# EAGLE board c65Keyb (EAGLE 7.1.0), part 1 of 2
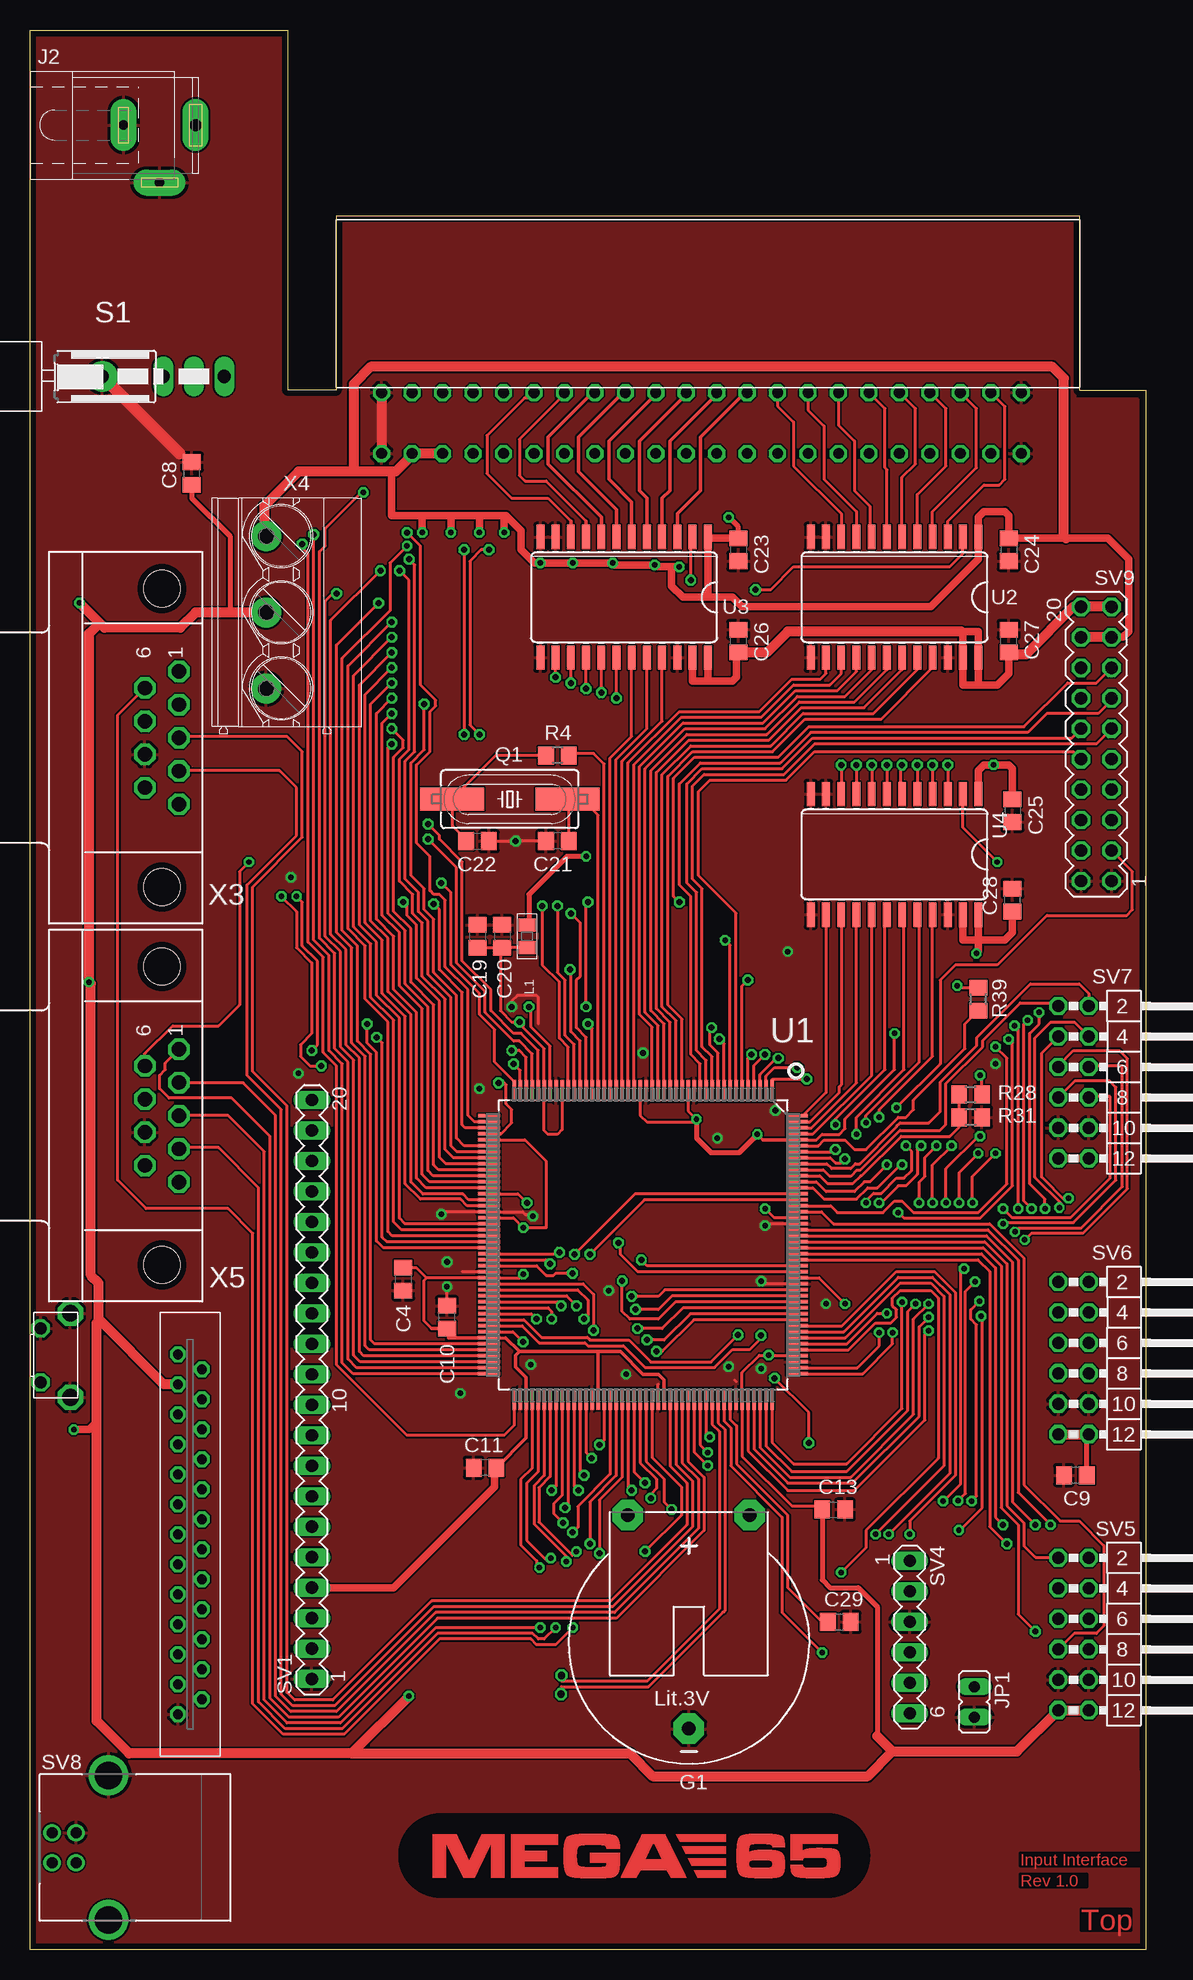
[diagram p2: board, top side]
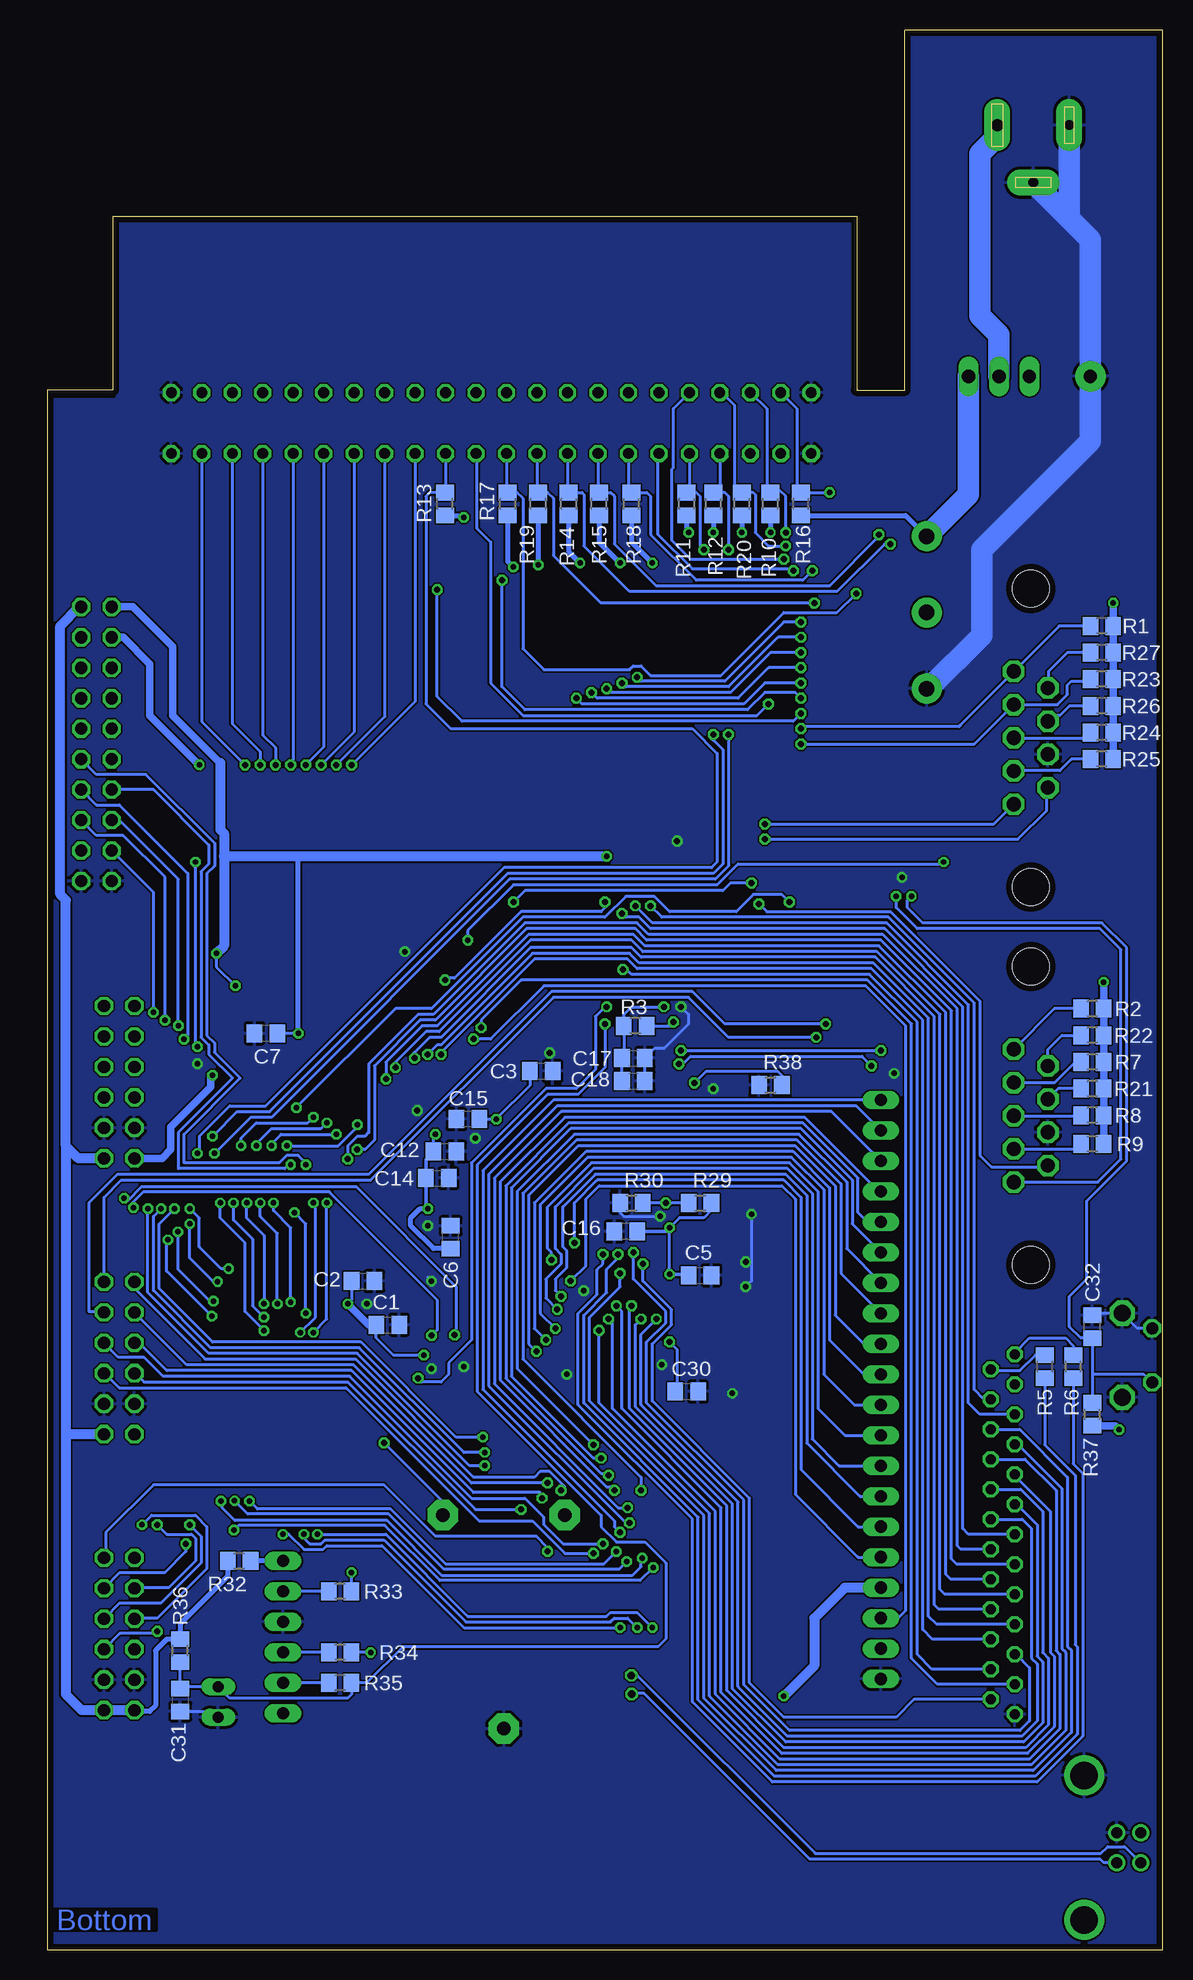
[diagram p3: board, bottom side, seen from below]

Size 93 x 160 mm. Coordinates in mm from the lower left corner, seen from the top.
Outline: 0,0 0,160 21.5,160 21.5,130 25.5,130 25.5,144.5 87.5,144.5 87.5,130 93,130 93,0 0,0
Copper layers (1*16): Top 0.035mm / dielectric 1.5mm / Bottom 0.035mm
Design rules "default *": minimum track width 0mil, minimum drill 18mil, track to track 6mil, track to pad 6mil, pad to pad 6mil, via to via 6mil, smd to smd 6mil, copper to edge 20mil, drill to drill 8mil, minimum pad ring 10mil, minimum via ring 8mil, stop-mask expansion 4mil, vias tented up to drill 0mil, thermal gap 10mil
tRestrict: area 34.1,4.3 to 66.6,4.3; area 34,4.3 to 66.8,4.3; area 33.9,4.3 to 66.9,4.3; area 33.8,4.3 to 66.9,4.4; area 33.7,4.4 to 67,4.4; area 33.7,4.4 to 67.1,4.4; area 33.6,4.4 to 67.1,4.4; area 33.6,4.4 to 67.2,4.4; area 33.5,4.4 to 67.2,4.4; area 33.5,4.4 to 67.3,4.4; area 33.4,4.4 to 67.3,4.4; area 33.4,4.4 to 67.4,4.4; 4388 more areas

## Footprints (pad centres in the part's own frame; a part is rotated, then mirrored left to right if it is on the bottom)
C0805 = smd 1.3 x 1.5: 1 -0.95,0; 2 0.95,0
CR2032H = drill 1.118 pad 2.54 octagon: + 5.08,10.795; +@1 -5.08,10.795; - 0,-6.985
SPC4078 = drill 0.8 pad 2.184 long: 1 -3,0; 2 0,-4.8 | drill 1 pad 2.184 long: 3 3,0
JP1 = drill 0.914 long: 1 0,-1.27; 2 0,1.27
SMD0805-ALT = smd 1.092 x 1.397: 1 -0.94,0; 2 0.94,0
HC49UP = smd 5.334 x 1.93: 1 -4.826,0; 2 4.826,0
R0805 = smd 1.3 x 1.5: 1 -0.95,0; 2 0.95,0
LPV-1 = drill 1.1 long: 1 0,20.32; 2 0,22.86; 3 0,25.4 | drill 1.1 pad 2.54: B1 0,15.24
MA20-1 = drill 1.016 long: 1 -24.13,0; 2 -21.59,0; 3 -19.05,0; 4 -16.51,0; 5 -13.97,0; 6 -11.43,0; 7 -8.89,0; 8 -6.35,0; 9 -3.81,0; 10 -1.27,0; 11 1.27,0; 12 3.81,0; 13 6.35,0; 14 8.89,0; 15 11.43,0; 16 13.97,0; 17 16.51,0; 18 19.05,0; 19 21.59,0; 20 24.13,0
C65_MOLEX_KEYB = drill 0.8 octagon: 1 -15,1; 2 -13.75,-1; 3 -12.5,1; 4 -11.25,-1; 5 -10,1; 6 -8.75,-1; 7 -7.5,1; 8 -6.25,-1; 9 -5,1; 10 -3.75,-1; 11 -2.5,1; 12 -1.25,-1; 13 0,1; 14 1.25,-1; 15 2.5,1; 16 3.75,-1; 17 5,1; 18 6.25,-1; 19 7.5,1; 20 8.75,-1; 21 10,1; 22 11.25,-1; 23 12.5,1; 24 13.75,-1; 25 15,1
EDGE-CON-44 = drill 0.9 pad 1.422 octagon: 1 3.81,0; 2 6.35,0; 3 8.89,0; 4 11.43,0; 5 13.97,0; 6 16.51,0; 7 19.05,0; 8 21.59,0; 9 24.13,0; 10 26.67,0; 11 29.21,0; 12 31.75,0; 13 34.29,0; 14 36.83,0; 15 39.37,0; 16 41.91,0; 17 44.45,0; 18 46.99,0; 19 49.53,0; 20 52.07,0; 21 54.61,0; 22 57.15,0; A 3.81,5.08; B 6.35,5.08; C 8.89,5.08; D 11.43,5.08; E 13.97,5.08; F 16.51,5.08; H 19.05,5.08; J 21.59,5.08; K 24.13,5.08; L 26.67,5.08; M 29.21,5.08; N 31.75,5.08; P 34.29,5.08; R 36.83,5.08; S 39.37,5.08; T 41.91,5.08; U 44.45,5.08; V 46.99,5.08; W 49.53,5.08; X 52.07,5.08; Y 54.61,5.08; Z 57.15,5.08
MA06-1 = drill 1.016 long: 1 -6.35,0; 2 -3.81,0; 3 -1.27,0; 4 1.27,0; 5 3.81,0; 6 6.35,0
MA06-2W = drill 1.016 octagon: 1 -6.35,-1.27; 2 -6.35,1.27; 3 -3.81,-1.27; 4 -3.81,1.27; 5 -1.27,-1.27; 6 -1.27,1.27; 7 1.27,-1.27; 8 1.27,1.27; 9 3.81,-1.27; 10 3.81,1.27; 11 6.35,-1.27; 12 6.35,1.27
USB-B-THG-01 = drill 0.92: 1 1.25,14.99; 2 -1.25,14.99; 3 -1.25,12.99; 4 1.25,12.99 | drill 2.3: G1 6.02,10.28; G2 -6.02,10.28
MA10-2 = drill 1.016 octagon: 1 -11.43,-1.27; 2 -11.43,1.27; 3 -8.89,-1.27; 4 -8.89,1.27; 5 -6.35,-1.27; 6 -6.35,1.27; 7 -3.81,-1.27; 8 -3.81,1.27; 9 -1.27,-1.27; 10 -1.27,1.27; 11 1.27,-1.27; 12 1.27,1.27; 13 3.81,-1.27; 14 3.81,1.27; 15 6.35,-1.27; 16 6.35,1.27; 17 8.89,-1.27; 18 8.89,1.27; 19 11.43,-1.27; 20 11.43,1.27
MICRO_SWITCH = drill 1 octagon: 1 -2.25,0.56; 2 2.25,0.56 | drill 1.4 octagon: 3 -3.505,3.05; 4 3.505,3.05
QFP176 = smd 1.8 x 0.3: 1 -12.85,10.75; 2 -12.85,10.25; 3 -12.85,9.75; 4 -12.85,9.25; 5 -12.85,8.75; 6 -12.85,8.25; 7 -12.85,7.75; 8 -12.85,7.25; 9 -12.85,6.75; 10 -12.85,6.25; 11 -12.85,5.75; 12 -12.85,5.25; 13 -12.85,4.75; 14 -12.85,4.25; 15 -12.85,3.75; 16 -12.85,3.25; 17 -12.85,2.75; 18 -12.85,2.25; 19 -12.85,1.75; 20 -12.85,1.25; 21 -12.85,0.75; 22 -12.85,0.25; 23 -12.85,-0.25; 24 -12.85,-0.75; 25 -12.85,-1.25; 26 -12.85,-1.75; 27 -12.85,-2.25; 28 -12.85,-2.75; 29 -12.85,-3.25; 30 -12.85,-3.75; 31 -12.85,-4.25; 32 -12.85,-4.75; 33 -12.85,-5.25; 34 -12.85,-5.75; 35 -12.85,-6.25; 36 -12.85,-6.75; 37 -12.85,-7.25; 38 -12.85,-7.75; 39 -12.85,-8.25; 40 -12.85,-8.75; 41 -12.85,-9.25; 42 -12.85,-9.75; 43 -12.85,-10.25; 44 -12.85,-10.75; 89 12.85,-10.75; 90 12.85,-10.25; 91 12.85,-9.75; 92 12.85,-9.25; 93 12.85,-8.75; 94 12.85,-8.25; 95 12.85,-7.75; 96 12.85,-7.25; 97 12.85,-6.75; 98 12.85,-6.25; 99 12.85,-5.75; 100 12.85,-5.25; 101 12.85,-4.75; 102 12.85,-4.25; 103 12.85,-3.75; 104 12.85,-3.25; 105 12.85,-2.75; 106 12.85,-2.25; 107 12.85,-1.75; 108 12.85,-1.25; 109 12.85,-0.75; 110 12.85,-0.25; 111 12.85,0.25; 112 12.85,0.75; 113 12.85,1.25; 114 12.85,1.75; 115 12.85,2.25; 116 12.85,2.75; 117 12.85,3.25; 118 12.85,3.75; 119 12.85,4.25; 120 12.85,4.75; 121 12.85,5.25; 122 12.85,5.75; 123 12.85,6.25; 124 12.85,6.75; 125 12.85,7.25; 126 12.85,7.75; 127 12.85,8.25; 128 12.85,8.75; 129 12.85,9.25; 130 12.85,9.75; 131 12.85,10.25; 132 12.85,10.75 | smd 0.3 x 1.8: 45 -10.75,-12.85; 46 -10.25,-12.85; 47 -9.75,-12.85; 48 -9.25,-12.85; 49 -8.75,-12.85; 50 -8.25,-12.85; 51 -7.75,-12.85; 52 -7.25,-12.85; 53 -6.75,-12.85; 54 -6.25,-12.85; 55 -5.75,-12.85; 56 -5.25,-12.85; 57 -4.75,-12.85; 58 -4.25,-12.85; 59 -3.75,-12.85; 60 -3.25,-12.85; 61 -2.75,-12.85; 62 -2.25,-12.85; 63 -1.75,-12.85; 64 -1.25,-12.85; 65 -0.75,-12.85; 66 -0.25,-12.85; 67 0.25,-12.85; 68 0.75,-12.85; 69 1.25,-12.85; 70 1.75,-12.85; 71 2.25,-12.85; 72 2.75,-12.85; 73 3.25,-12.85; 74 3.75,-12.85; 75 4.25,-12.85; 76 4.75,-12.85; 77 5.25,-12.85; 78 5.75,-12.85; 79 6.25,-12.85; 80 6.75,-12.85; 81 7.25,-12.85; 82 7.75,-12.85; 83 8.25,-12.85; 84 8.75,-12.85; 85 9.25,-12.85; 86 9.75,-12.85; 87 10.25,-12.85; 88 10.75,-12.85; 133 10.75,12.85; 134 10.25,12.85; 135 9.75,12.85; 136 9.25,12.85; 137 8.75,12.85; 138 8.25,12.85; 139 7.75,12.85; 140 7.25,12.85; 141 6.75,12.85; 142 6.25,12.85; 143 5.75,12.85; 144 5.25,12.85; 145 4.75,12.85; 146 4.25,12.85; 147 3.75,12.85; 148 3.25,12.85; 149 2.75,12.85; 150 2.25,12.85; 151 1.75,12.85; 152 1.25,12.85; 153 0.75,12.85; 154 0.25,12.85; 155 -0.25,12.85; 156 -0.75,12.85; 157 -1.25,12.85; 158 -1.75,12.85; 159 -2.25,12.85; 160 -2.75,12.85; 161 -3.25,12.85; 162 -3.75,12.85; 163 -4.25,12.85; 164 -4.75,12.85; 165 -5.25,12.85; 166 -5.75,12.85; 167 -6.25,12.85; 168 -6.75,12.85; 169 -7.25,12.85; 170 -7.75,12.85; 171 -8.25,12.85; 172 -8.75,12.85; 173 -9.25,12.85; 174 -9.75,12.85; 175 -10.25,12.85; 176 -10.75,12.85
SO24L = smd 0.66 x 2.032: 1 -6.985,-5.029; 2 -5.715,-5.029; 3 -4.445,-5.029; 4 -3.175,-5.029; 5 -1.905,-5.029; 6 -0.635,-5.029; 7 0.635,-5.029; 8 1.905,-5.029; 9 3.175,-5.029; 10 4.445,-5.029; 11 5.715,-5.029; 12 6.985,-5.029; 13 6.985,5.029; 14 5.715,5.029; 15 4.445,5.029; 16 3.175,5.029; 17 1.905,5.029; 18 0.635,5.029; 19 -0.635,5.029; 20 -1.905,5.029; 21 -3.175,5.029; 22 -4.445,5.029; 23 -5.715,5.029; 24 -6.985,5.029
182-009-MALE = drill 1.194 pad 1.524 octagon: 1 -5.537,10.923; 2 -2.769,10.923; 3 0,10.923; 4 2.769,10.923; 5 5.537,10.923; 6 -4.153,8.08; 7 -1.384,8.08; 8 1.384,8.08; 9 4.153,8.08 | hole 3.048: -12.446,9.501; 12.446,9.501
MKDS_5/3-635 = drill 1.3 pad 2.5: 1 -6.35,0; 2 0,0; 3 6.35,0

## Placement (x,y rotation side)
C1  100nF  [C0805]  64.61,52.07 0 bottom
C2  100nF  [C0805]  66.67,55.72 0 bottom
C3  100nF  [C0805]  51.81,73.22 0 bottom
C4  100nF  [C0805]  31.11,55.88 270 top
C5  100nF  [C0805]  38.58,56.2 0 bottom
C6  100nF  [C0805]  59.37,59.37 90 bottom
C7  100nF  [C0805]  74.77,76.36 180 bottom
C8  100nF  [C0805]  13.49,123.03 90 top
C9  100nF  [C0805]  87.15,39.53 180 top
C10  100nF  [C0805]  34.77,52.7 90 top
C11  100nF  [C0805]  37.94,40.16 180 top
C12  100nF  [C0805]  59.85,66.52 0 bottom
C13  100nF  [C0805]  66.99,36.67 0 top
C14  100nF  [C0805]  60.48,64.29 0 bottom
C15  1µF  [C0805]  57.94,69.22 180 bottom
C16  1µF  [C0805]  44.77,59.85 180 bottom
C17  100nF  [C0805]  44.13,74.3 0 bottom
C18  1µF  [C0805]  44.13,72.39 0 bottom
C19  1µF  [C0805]  37.31,84.45 270 top
C20  100nF  [C0805]  39.37,84.45 270 top
C21  33pF  [C0805]  43.97,92.39 180 top
C22  33pF  [C0805]  37.31,92.39 0 top
C23  100nF  [C0805]  59.05,116.68 270 top
C24  100nF  [C0805]  81.6,116.68 270 top
C25  100nF  [C0805]  81.92,94.93 270 top
C26  100nF  [C0805]  59.05,109.06 90 top
C27  100nF  [C0805]  81.6,109.06 90 top
C28  100nF  [C0805]  81.92,87.47 90 top
C29  2,2µF  [C0805]  67.47,27.3 0 top
C30  2,2µF  [C0805]  39.69,46.51 0 bottom
C31  100nF  [C0805]  81.92,20.8 270 bottom
C32  100nF  [C0805]  5.87,51.91 90 bottom
G1  CR2032H  [CR2032H]  54.93,25.4 0 top
J2  [SPC4078]  10.79,152.08 0 top
JP1  [JP1]  78.74,20.64 180 top
L1  [SMD0805-ALT]  41.43,84.45 90 top
Q1  8Mhz  [HC49UP]  40.01,95.89 0 top
R1  1k  [R0805]  5.08,110.33 180 bottom
R2  1k  [R0805]  5.87,78.42 180 bottom
R3  47R  [R0805]  43.97,76.99 180 bottom
R4  220R  [R0805]  43.97,99.54 180 top
R5  100R  [R0805]  9.84,48.58 90 bottom
R6  100R  [R0805]  7.46,48.58 90 bottom
R7  1k  [R0805]  5.87,73.98 180 bottom
R8  1k  [R0805]  5.87,69.53 180 bottom
R9  1k  [R0805]  5.87,67.15 180 bottom
R10  3k3  [R0805]  32.7,120.49 90 bottom
R11  3k3  [R0805]  39.69,120.49 90 bottom
R12  3k3  [R0805]  37.47,120.49 90 bottom
R13  3k3  [R0805]  59.85,120.49 90 bottom
R14  3k3  [R0805]  49.53,120.49 90 bottom
R15  3k3  [R0805]  46.99,120.49 90 bottom
R16  3k3  [R0805]  30.16,120.49 90 bottom
R17  3k3  [R0805]  54.61,120.49 90 bottom
R18  3k3  [R0805]  44.29,120.49 90 bottom
R19  3k3  [R0805]  52.07,120.49 90 bottom
R20  3k3  [R0805]  35.08,120.49 90 bottom
R21  47R  [R0805]  5.87,71.75 180 bottom
R22  1k  [R0805]  5.87,76.2 180 bottom
R23  1k  [R0805]  5.08,105.89 180 bottom
R24  1k  [R0805]  5.08,101.44 180 bottom
R25  1k  [R0805]  5.08,99.22 180 bottom
R26  47R  [R0805]  5.08,103.66 180 bottom
R27  1k  [R0805]  5.08,108.11 180 bottom
R28  10k  [R0805]  78.42,71.28 0 top
R29  10k  [R0805]  38.58,62.23 0 bottom
R30  510R  [R0805]  44.29,62.23 0 bottom
R31  510R  [R0805]  78.42,69.37 180 top
R32  47R  [R0805]  76.99,32.38 180 bottom
R33  47R  [R0805]  68.58,29.84 180 bottom
R34  47R  [R0805]  68.58,24.77 180 bottom
R35  47R  [R0805]  68.58,22.23 180 bottom
R36  100k  [R0805]  81.92,24.92 90 bottom
R37  3k3  [R0805]  5.87,44.61 90 bottom
R38  10k  [R0805]  32.7,72.07 0 bottom
R39  10k  [R0805]  79.06,79.22 90 top
S1  [LPV-1]  -9.21,131.13 270 top
SV1  [MA20-1]  23.5,46.67 90 top
SV2  [C65_MOLEX_KEYB]  13.34,34.61 90 top
SV3  EDGE-CON-44P  [EDGE-CON-44]  25.5,124.7 0 top
SV4  [MA06-1]  73.34,26.04 270 top
SV5  [MA06-2W]  87,26.3 270 top
SV6  [MA06-2W]  87,49.3 270 top
SV7  [MA06-2W]  87,72.3 270 top
SV8  USB-B-G-B  [USB-B-THG-01]  16.83,8.49 90 top
SV9  [MA10-2]  88.9,100.49 90 top
SW1  [MICRO_SWITCH]  0.32,49.53 270 top
U1  STM32F407IET6__FI__  [QFP176]  51.12,58.74 270 top
U2  744245  [SO24L]  72.07,112.71 180 top
U3  744245  [SO24L]  49.53,112.71 180 top
U4  744245  [SO24L]  72.07,91.28 180 top
X3  [182-009-MALE]  1.5,101 270 top
X4  MKDS_5/3-6,35  [MKDS_5/3-635]  19.68,111.44 90 top
X5  [182-009-MALE]  1.5,69.5 270 top